# EasyEDA Pro project Samuel_Quenching.eprj

# Schematic NV_Quenching_Schematic
Board Name: Samuel; Create Date: 2026-01-16; Page Name: P1; Project Name: Samuel_Quenching; Schematic Name: NV_Quenching_Schematic; Update Date: 2026-01-16; Company: Fraunhofer IAO; Drawn: Jens; Page Size: A4; Reviewed: Samuel; Version: V2.0
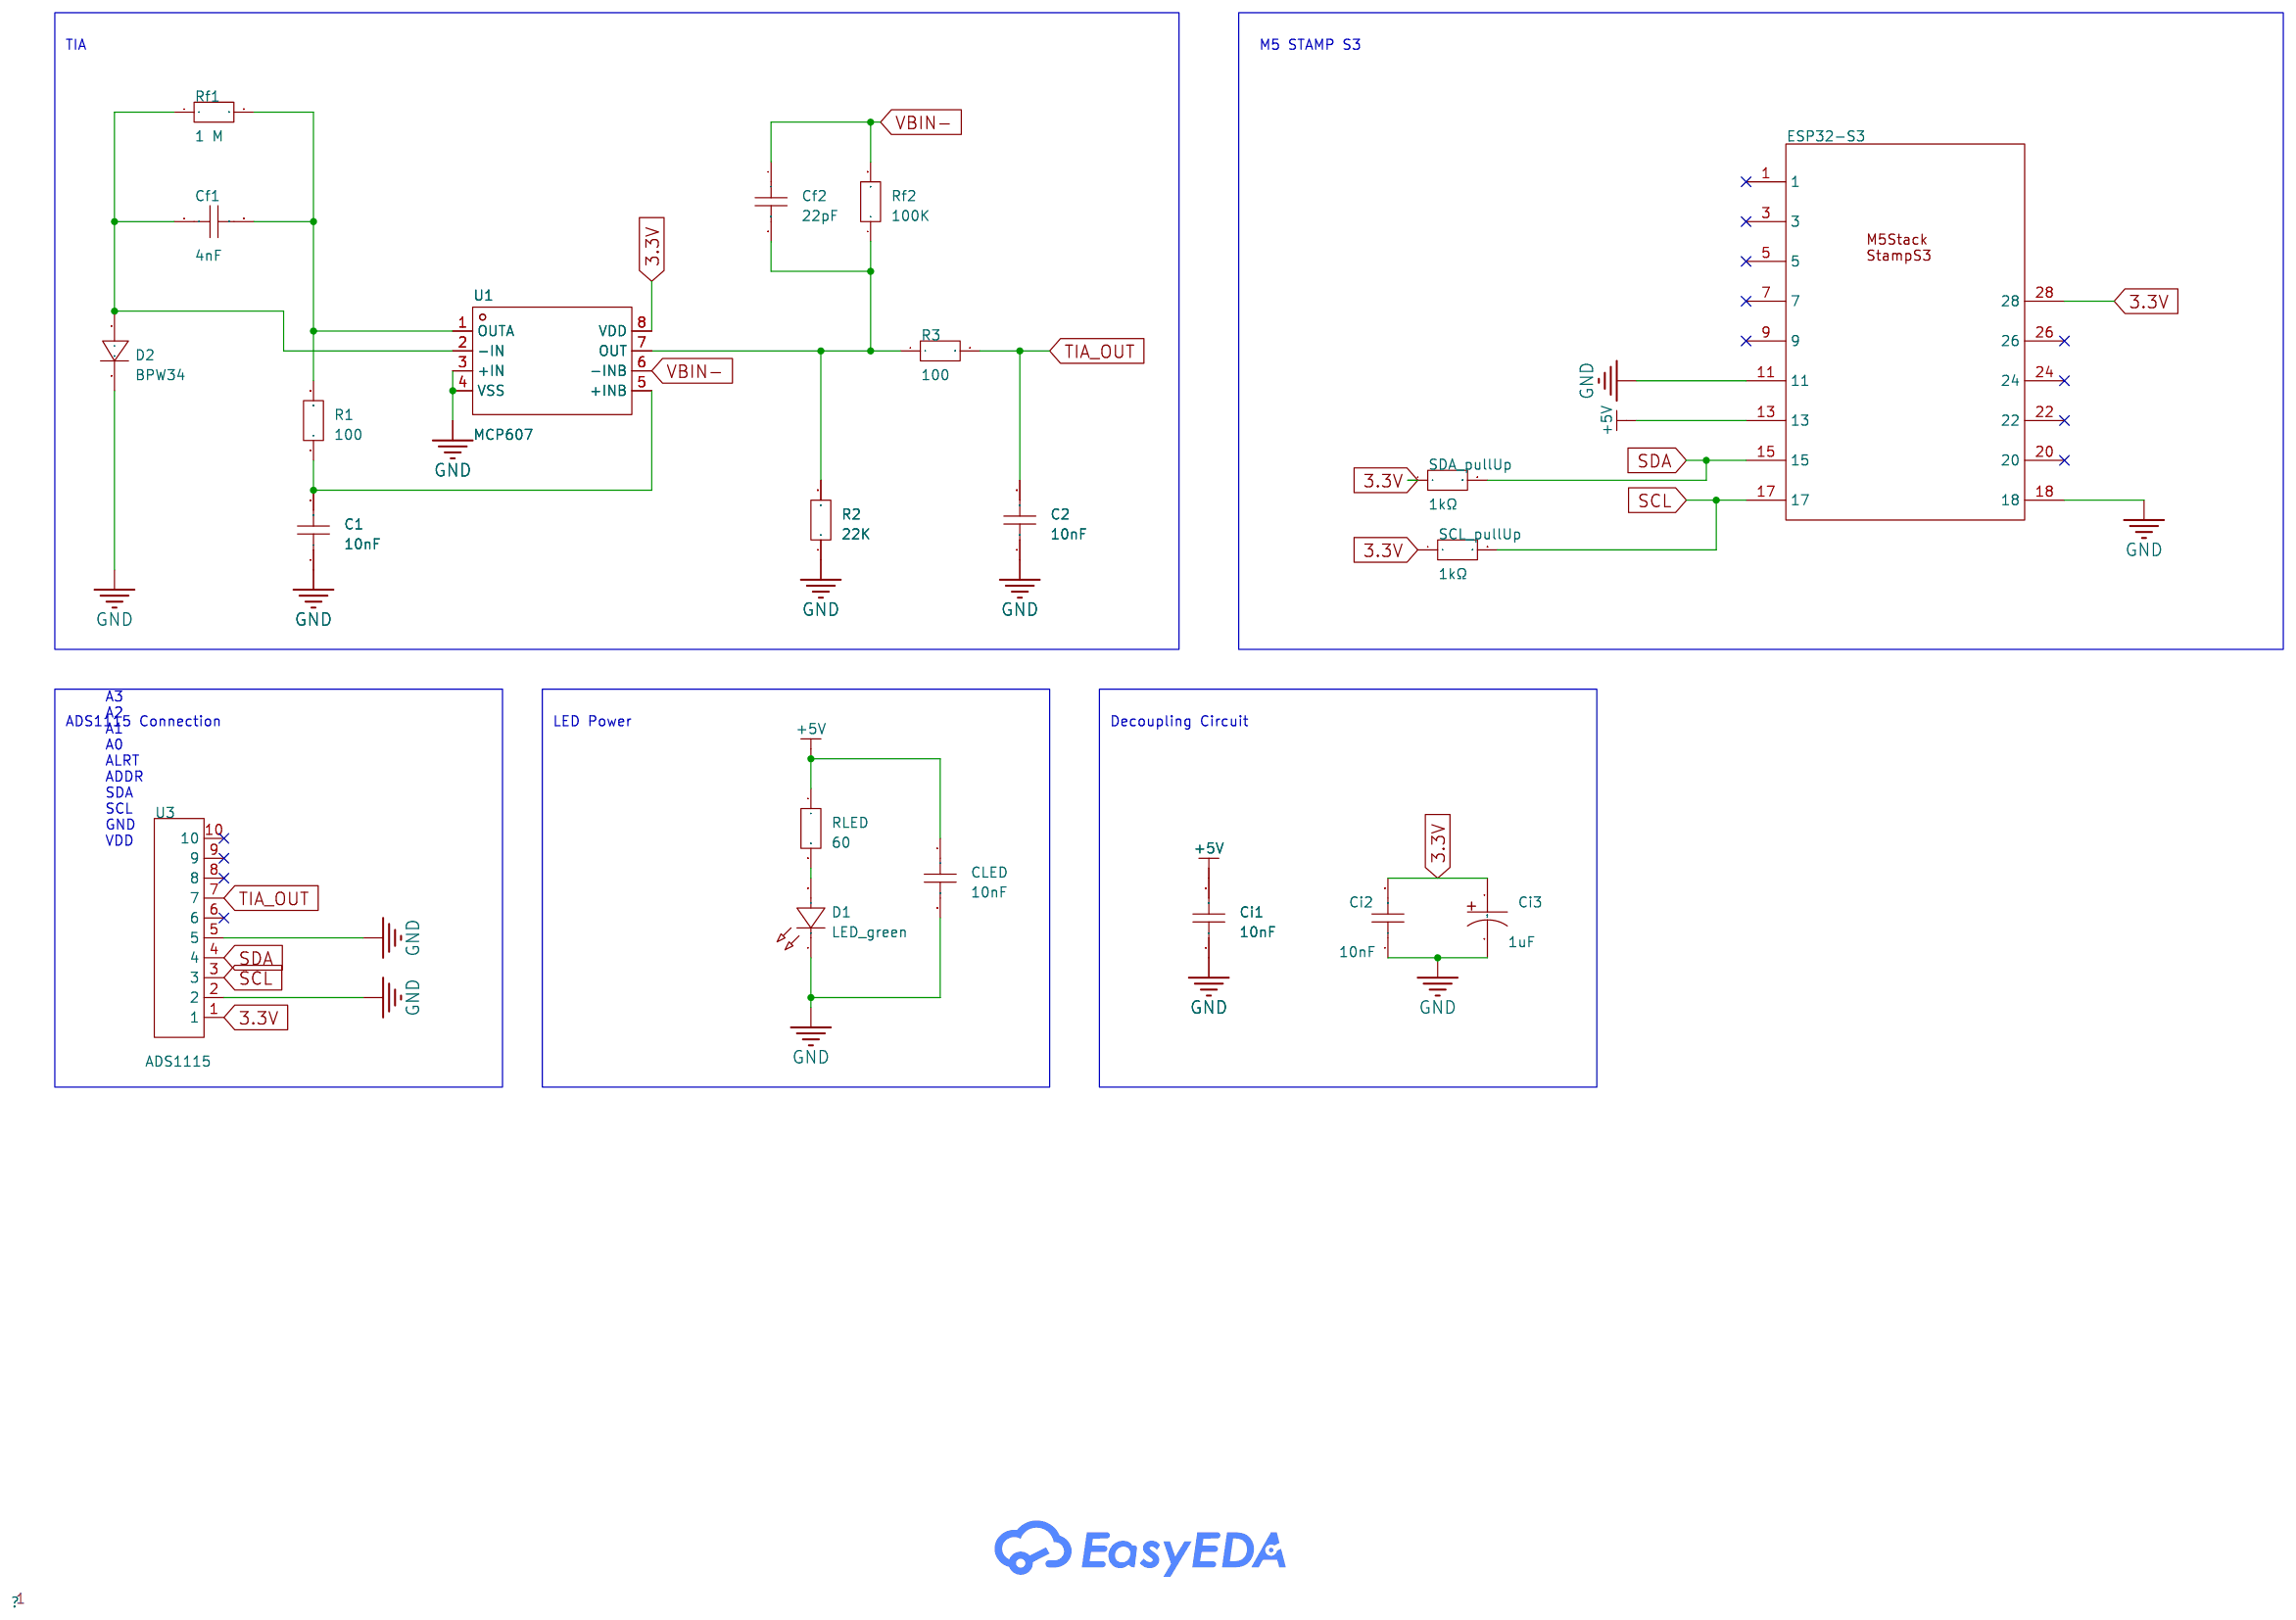
[diagram p0: schematic sheet]

## Parts
C1  2.2nF  [CAP-TH_L6.0-W3.0-P5.00-D1.0]
C2  2.2nF  [CAP-TH_L6.0-W3.0-P5.00-D1.0]
Cf1  2.2nF  [CAP-TH_L6.0-W3.0-P5.00-D1.0]
Cf2  2.2nF  [CAP-TH_L6.0-W3.0-P5.00-D1.0]
Ci1  2.2nF  [CAP-TH_L6.0-W3.0-P5.00-D1.0]
Ci2  2.2nF  [CAP-TH_L6.0-W3.0-P5.00-D1.0]
Ci3  20F  [CAP-TH_BD5.0-P2.00-D0.5-FD_CD26G2AM1R0D110T]
CLED  2.2nF  [CAP-TH_L6.0-W3.0-P5.00-D1.0]
D1  LED_green  [LED-TH_BD3.5-P2.28-3A2K-10]
D2  BPW34  [SENSOR-TH_BPW34]
ESP32-S3  U2  [M5Stack StampS3 ]  (no BOM)
R1  1kΩ  [RES-TH_BD2.3-L6.5-P10.50-D0.5]
R2  1kΩ  [RES-TH_BD2.3-L6.5-P10.50-D0.5]
R3  1kΩ  [RES-TH_BD2.3-L6.5-P10.50-D0.5]
Rf1  1kΩ  [RES-TH_BD2.3-L6.5-P10.50-D0.5]
Rf2  1kΩ  [RES-TH_BD2.3-L6.5-P10.50-D0.5]
RLED  1kΩ  [RES-TH_BD2.3-L6.5-P10.50-D0.5]
SCL_pullUp  1kΩ  [RES-TH_BD2.3-L6.5-P10.50-D0.5]
SDA_pullUp  1kΩ  [RES-TH_BD2.3-L6.5-P10.50-D0.5]
U1  MCP607  [DIP-8_L9.4-W6.4-P2.54-LS9.1-BL]
U3  ADS1115  [HDR-TH_10P-P2.54-V-M-1]

## Library data of the parts
C1 C2 Cf1 Cf2 Ci1 Ci2 CLED = R06F1B222MN0B0S0N0: Capacitance:2.2nF Tolerance:±20% Tolerance:±20% Voltage Rating:2kV Pin Spacing:5mm Temperature Coefficient:Y5V Diameter:6mm Body Thickness:3mm; LCSC Part Name: 2.2nF ±20% 2kV; Supplier Part: C249167; Manufacturer: STE(松田); Supplier Footprint: 插件,P=5mm; JLCPCB Part Class: Extended Part; Datasheet: https://item.szlcsc.com/datasheet/R06F1B222MN0B0S0N0/245526.html; Supplier: LCSC; Tolerance: ±20%; Voltage Rating: 2kV; Pin Spacing: 5mm; Temperature Coefficient: Y5V; Diameter: 6mm; Body Thickness: 3mm
Ci3 = SLA3R8O2060813: Capacitance:20F Tolerance:-10%~+30% Tolerance:-10%~+30% Voltage Rating:3.8V Equivalent Series Resistance(ESR):500mΩ Current - Leakage:- Lifetime:1000hrs@85℃ Operating Temperature:-40℃~+85℃ Operating Temperature:-40℃~+85℃ Diameter:8mm Height - Seated(Max):; LCSC Part Name: 20F -10%~+30% 3.8V; Supplier Part: C970391; Manufacturer: Ymin(永铭); Supplier Footprint: 插件,P=3.5mm; JLCPCB Part Class: Extended Part; Datasheet: https://item.szlcsc.com/datasheet/SLA3R8O2060813/1059775.html; Supplier: LCSC; Tolerance: -10%~+30%; Voltage Rating: 3.8V; Equivalent Series Resistance(ESR): 500mΩ; Lifetime: 1000hrs@85℃; Operating Temperature: -40℃~+85℃; Diameter: 8mm
D1 = 3A2K-10: Voltage - DC Reverse(Vr):30V Peak Wavelength:940nm Spectral Range:760nm~1100nm Spectral Range:760nm~1100nm Dark Current:100nA Operating Temperature:-40℃~+85℃ Operating Temperature:-40℃~+85℃; LCSC Part Name: 3mm黑色红外光敏接收管; Supplier Part: C52034729; Manufacturer: Guiguang light(桂光光电); Supplier Footprint: 插件,D=3mm; JLCPCB Part Class: Extended Part; Datasheet: https://item.szlcsc.com/datasheet/3A2K-10/54791047.html; Supplier: LCSC; Voltage - DC Reverse(Vr): 30V; Peak Wavelength: 940nm; Spectral Range: 760nm~1100nm; Dark Current: 100nA; Operating Temperature: -40℃~+85℃
D2 = BPW34: Voltage - DC Reverse(Vr):60V Viewing Angle:±65° Peak Wavelength:900nm Spectral Range:430nm~1100nm Spectral Range:430nm~1100nm Dark Current:2nA Operating Temperature:-40℃~+100℃ Operating Temperature:-40℃~+100℃ Pd - Power Dissipation:215mW; LCSC Part Name: 900nm 频谱范围430nm~1100nm 反向电压60V; Supplier Part: C85128; Manufacturer: VISHAY(威世); Supplier Footprint: 插件,P=5.1mm; JLCPCB Part Class: Extended Part; Datasheet: https://item.szlcsc.com/datasheet/BPW34/86300.html; Supplier: LCSC; Voltage - DC Reverse(Vr): 60V; Viewing Angle: ±65°; Peak Wavelength: 900nm; Spectral Range: 430nm~1100nm; Dark Current: 2nA; Operating Temperature: -40℃~+100℃; Pd - Power Dissipation: 215mW
ESP32-S3 = Esp32-S3 M5Stamp
R1-R3 Rf1 Rf2 RLED SCL_pullUp SDA_pullUp = MF1/4W-1KΩ±1%T52: Type:Metal Film Resistors Resistance: Tolerance:±1% Tolerance:±1% Power(Watts):250mW Temperature Coefficient:±200ppm/℃ Temperature Coefficient:±200ppm/℃; LCSC Part Name: 金属膜电阻 1kΩ ±1% 250mW; Supplier Part: C713997; Manufacturer: 华星机电; Supplier Footprint: 插件,D2.3xL6.5mm; JLCPCB Part Class: Extended Part; Datasheet: https://atta.szlcsc.com/upload/public/pdf/source/20200731/C713882_AE8EB1102749D7E4FB4FB13DC898C429.pdf; Supplier: LCSC; Type: Metal Film Resistors; Tolerance: ±1%; Power(Watts): 250mW; Temperature Coefficient: ±200ppm/℃
U1 = MCP607-I/P: Number of Circuits:双路 Gain Bandwidth Product(GBP):155kHz Current - Input Bias(Ib):1pA Slew Rate(SR):0.08V/us Output Current:17mA -3db Bandwidth:- Output Type:- Rail to Rail:- Supply Current:18.7uA Operating Temperature:-40℃~+85℃ Operating Temperature:-40℃; Supplier Part: C57348; Manufacturer: MICROCHIP(美国微芯); Supplier Footprint: DIP-8; JLCPCB Part Class: Extended Part; Datasheet: https://atta.szlcsc.com/upload/public/pdf/source/20170105/1483610774992.pdf; Supplier: LCSC; Number of Circuits: 双路; Gain Bandwidth Product(GBP): 155kHz; Current - Input Bias(Ib): 1pA; Slew Rate(SR): 0.08V/us; Output Current: 17mA; Supply Current: 18.7uA; Operating Temperature: -40℃~+85℃
U3 = 2.54-1*10P针: Pin Structure:1x10P Pitch:2.54mm Row Spacing:- Circluar Pins/Square Pins:Policy Mounting Type:Straight Number of Rows:Single Row Number of Pins:10P Current Rating:3A Voltage Rating (Max):- Length of Mating Pin:- Insulation Height:- Length of End Connectio; LCSC Part Name: 1x10P 间距:2.54mm 方针 直插; Supplier Part: C57369; Manufacturer: BOOMELE(博穆精密); Supplier Footprint: 插件,P=2.54mm; JLCPCB Part Class: Extended Part; Datasheet: https://atta.szlcsc.com/upload/public/pdf/source/20151109/1457707572883.pdf; Supplier: LCSC; Pin Structure: 1x10P; Pitch: 2.54mm; Circluar Pins/Square Pins: Policy; Mounting Type: Straight; Number of Rows: Single Row; Number of Pins: 10P; Current Rating: 3A; Operating Temperature: -40℃~+105℃; Color: Black

## Nets
3.3V: Ci2.2 Ci3.1 ESP32-S3.28 SCL_pullUp.1 SDA_pullUp.1 U1.8(VDD) U3.1
+5V: Ci1.2 CLED.1 ESP32-S3.13 RLED.1
GND: C1.1 C2.1 Ci1.1 Ci2.1 Ci3.2 CLED.2 D1.1(C) D2.2(C) ESP32-S3.11 ESP32-S3.18 R2.1 U1.3(+IN) U1.4(VSS) U3.2 U3.5
SCL: ESP32-S3.17 SCL_pullUp.2 U3.3
SDA: ESP32-S3.15 SDA_pullUp.2 U3.4
TIA_OUT: C2.2 R3.2 U3.7
VBIN-: Cf2.1 Rf2.2 U1.6(-INB)
$1N1714: D1.2(A) RLED.2
$1N1854: Cf1.1 D2.1(A) Rf1.1 U1.2(-IN)
$1N1856: Cf1.2 R1.2 Rf1.2 U1.1(OUTA)
$1N1900: C1.2 R1.1 U1.5(+INB)
$1N1918: Cf2.2 R2.2 R3.1 Rf2.1 U1.7(OUT)

Not connected (* = marked no-connect by the designer): ESP32-S3 1* 3* 5* 7* 9* 20* 22* 24* 26*; U3 6* 8* 9* 10*

## Notes on the sheet
- TIA
- M5 STAMP S3
- ADS1115 Connection
- LED Power
- Decoupling Circuit
- A3
  A2
  A1
  A0
  ALRT
  ADDR
  SDA
  SCL
  GND
  VDD

# Board NV_Quenching_PCB
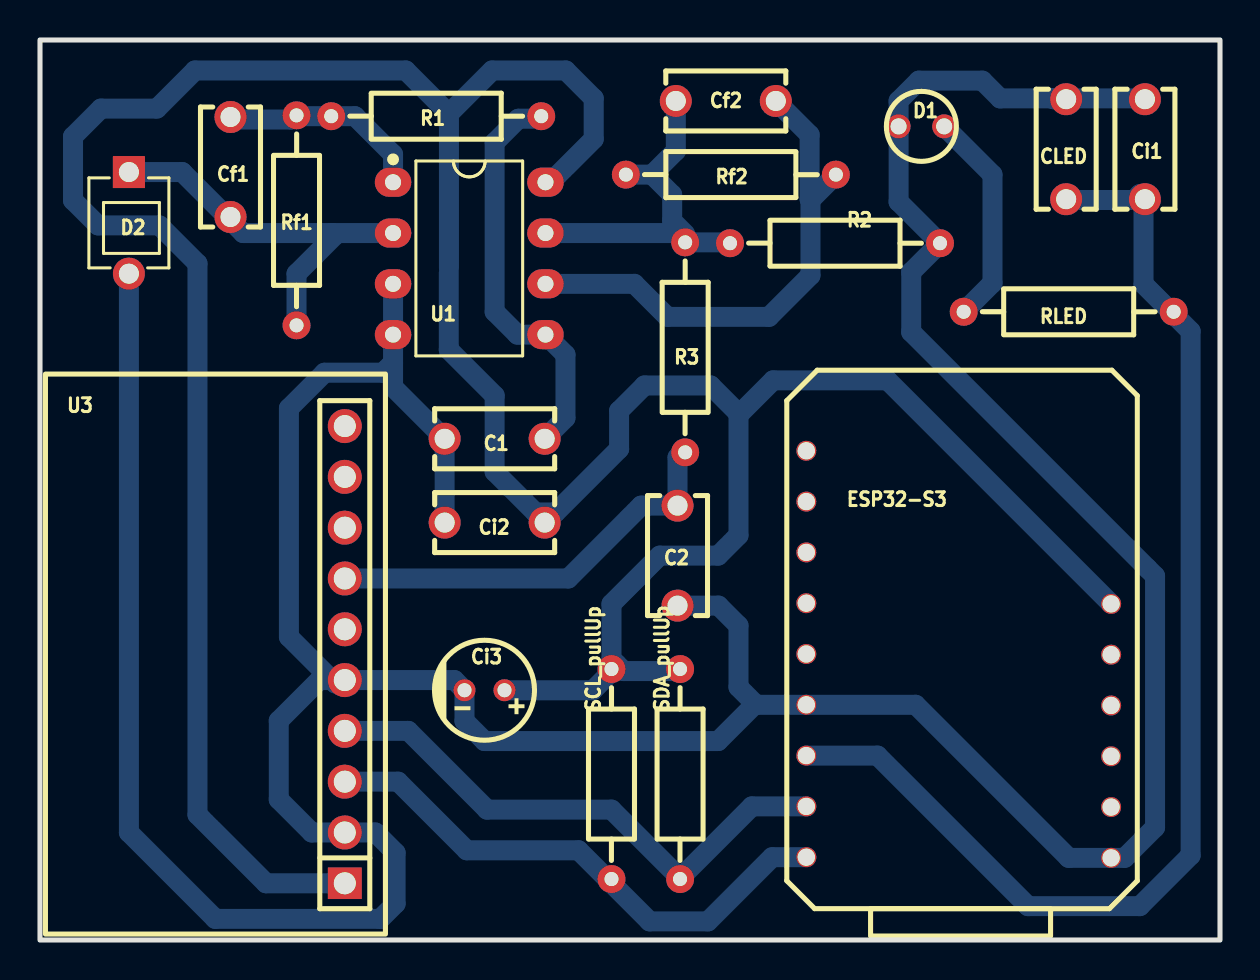
[diagram p1: board, top side]
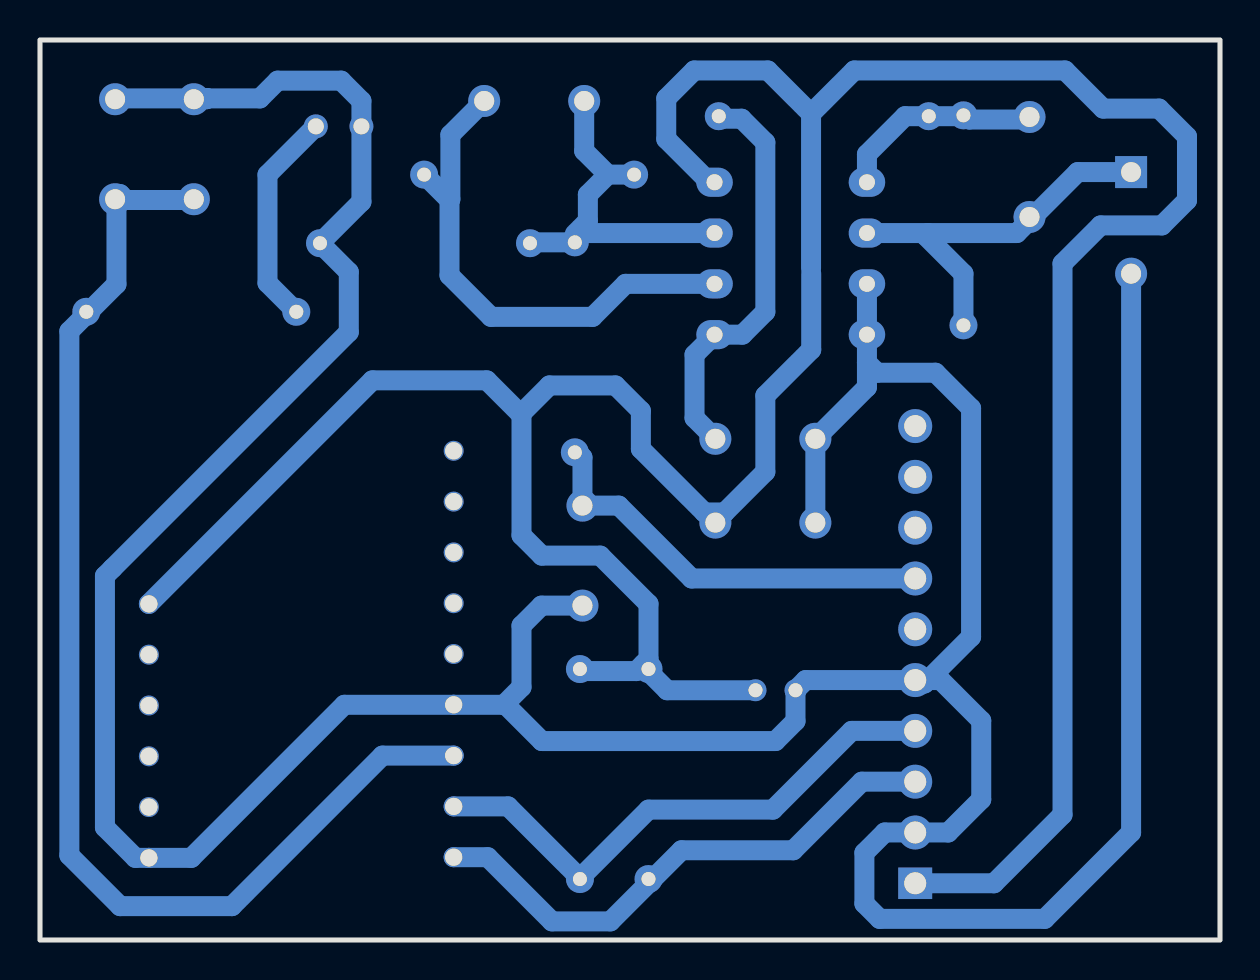
[diagram p2: board, bottom side, seen from below]

Outline 59 x 45 mm; copper layers: Top Layer, Bottom Layer. Coordinates in mm from the lower left corner of the outline.
Outline path: rectangle 0,45 59,0
Stack: Top Layer 0.035mm / Dielectric1 1.51mm FR4 er 4.5 / Bottom Layer 0.035mm

## Design rules (mm)
template: Custom Config
spacing copperThickness1oz (default): track to track 0.102, other pairs 0.152 to 0.3
spacing copperThickness2oz: track to track 0.203, other pairs 0.152 to 0.3
track width copperThickness1oz (default): min 0.254, default 0.54, max 2.54
track width copperThickness2oz: min 0.203, default 0.254, max 2.54
differential pair differentialPair (default): width min 0.127, default 0.254, max 2.54; gap min 0.152, default 0.152
via viaSize (default): diameter min 0.5, default 0.61, max 10; hole min 0.3, default 0.305, max 6.3
net GND uses copperRegion1, copperThickness2oz
net +5V uses copperThickness2oz
net 3.3V uses copperThickness2oz

## Placement (name value [footprint] x y rotation side)
C1  2.2nF  [CAP-TH_L6.0-W3.0-P5.00-D1.0]  22.73 25.06 0 top
C2  2.2nF  [CAP-TH_L6.0-W3.0-P5.00-D1.0]  31.88 19.22 90 top
Cf1  2.2nF  [CAP-TH_L6.0-W3.0-P5.00-D1.0]  9.53 38.65 90 top
Cf2  2.2nF  [CAP-TH_L6.0-W3.0-P5.00-D1.0]  34.29 41.95 180 top
Ci1  2.2nF  [CAP-TH_L6.0-W3.0-P5.00-D1.0]  55.25 39.54 270 top
Ci2  2.2nF  [CAP-TH_L6.0-W3.0-P5.00-D1.0]  22.73 20.87 0 top
Ci3  20F  [CAP-TH_BD5.0-P2.00-D0.5-FD_CD26G2AM1R0D110T]  22.22 12.49 180 top
CLED  2.2nF  [CAP-TH_L6.0-W3.0-P5.00-D1.0]  51.31 39.54 90 top
D1  LED_green  [LED-TH_BD3.5-P2.28-3A2K-10]  44.07 40.68 180 top
D2  BPW34  [SENSOR-TH_BPW34]  4.44 35.86 270 top
ESP32-S3  U2  [M5Stack StampS3 ]  45.85 14.52 0 top
R1  1kΩ  [RES-TH_BD2.3-L6.5-P10.50-D0.5]  19.81 41.19 180 top
R2  1kΩ  [RES-TH_BD2.3-L6.5-P10.50-D0.5]  39.75 34.84 180 top
R3  1kΩ  [RES-TH_BD2.3-L6.5-P10.50-D0.5]  32.26 29.63 270 top
Rf1  1kΩ  [RES-TH_BD2.3-L6.5-P10.50-D0.5]  12.83 35.98 90 top
Rf2  1kΩ  [RES-TH_BD2.3-L6.5-P10.50-D0.5]  34.54 38.27 0 top
RLED  1kΩ  [RES-TH_BD2.3-L6.5-P10.50-D0.5]  51.44 31.41 180 top
SCL_pullUp  1kΩ  [RES-TH_BD2.3-L6.5-P10.50-D0.5]  28.57 8.3 270 top
SDA_pullUp  1kΩ  [RES-TH_BD2.3-L6.5-P10.50-D0.5]  32 8.3 270 top
U1  MCP607  [DIP-8_L9.4-W6.4-P2.54-LS9.1-BL]  21.46 34.08 270 top
U3  ADS1115  [HDR-TH_10P-P2.54-V-M-1]  15.24 14.27 90 top

## Footprints (pads in the part's own frame, mm; a bottom-side part is the same pattern mirrored in y, then rotated)
CAP-TH_BD5.0-P2.00-D0.5-FD_CD26G2AM1R0D110T
  round 1.1 hole 0.7: 1(-1,0) 2(1,0)
CAP-TH_L6.0-W3.0-P5.00-D1.0
  round 1.6 hole 1: 1(-2.5,0) 2(2.5,0)
DIP-8_L9.4-W6.4-P2.54-LS9.1-BL
  oval 1.46x1.825 hole 0.8: 1(-3.81,-3.81) 2(-1.27,-3.81) 3(1.27,-3.81) 4(3.81,-3.81) 5(3.81,3.81) 6(1.27,3.81) 7(-1.27,3.81) 8(-3.81,3.81)
HDR-TH_10P-P2.54-V-M-1
  rect 1.575x1.7 hole 1.1: 1(-11.43,0)
  round 1.7 hole 1.1: 2(-8.89,0) 3(-6.35,0) 4(-3.81,0) 5(-1.27,0) 6(1.27,0) 7(3.81,0) 8(6.35,0) 9(8.89,0) 10(11.43,0)
LED-TH_BD3.5-P2.28-3A2K-10
  round 1.2 hole 0.8: 1(1.14,0) 2(-1.14,0)
M5Stack StampS3 
  round 1 hole 0.86: 1(-7.531,9.94) 3(-7.531,7.4) 5(-7.531,4.86) 7(-7.531,2.32) 9(-7.531,-0.22) 11(-7.531,-2.76) 13(-7.531,-5.3) 15(-7.531,-7.84) 17(-7.531,-10.38) 18(7.709,-10.414) 20(7.709,-7.874) 22(7.709,-5.334) 24(7.709,-2.794) 26(7.709,-0.254) 28(7.709,2.286)
RES-TH_BD2.3-L6.5-P10.50-D0.5
  round 1.4 hole 0.7: 1(-5.25,0) 2(5.25,0)
SENSOR-TH_BPW34
  rect 1.6x1.6 hole 1: 1(-2.54,0)
  round 1.6 hole 1: 2(2.54,0)

## Nets
As in the schematic.

Pads without a net: ESP32-S3 1 3 5 7 9 20 22 24 26; U3 6 8 9 10

## Routing (per net, layer and track width the routed paths; a pad name or vN(x,y) marks a point on that pad's centre or on a via; arc(x,y) is an arc through that point)
3.3V: length 168.6
  Bottom Layer w0.8: 28.83,13.8 SCL_pullUp.1
  Bottom Layer w1: 34.93,26.25 36.66,27.98 42.38,27.98 ESP32-S3.28 ; 34.93,26.25 34.93,20.23 33.91,19.22 30.99,19.22 28.57,16.81 28.57,14.06 29.18,13.45 31.9,13.45 SDA_pullUp.1 ; 34.93,26.25 34.93,26.33 33.53,27.73 30.23,27.73 28.96,26.46 28.96,24.55 25.78,21.38 24.76,21.38 22.73,23.41 22.73,27.22 20.44,29.51 20.44,33.32 ; 20.45,41.32 22.61,43.48 26.29,43.48 27.69,42.08 27.69,40.05 25.53,37.89 U1.8 ; 20.45,41.32 18.29,43.48 7.75,43.48 5.84,41.57 3.05,41.57 1.65,40.17 1.65,36.98 2.91,35.73 5.97,35.73 7.87,33.82 7.87,6.27 11.3,2.84 U3.1 ; 20.45,41.32 20.45,33.59 ; Ci3.1 27.64,12.49 28.64,13.48
+5V: length 61.4
  Bottom Layer w1: CLED.1 51.35,37 54.7,37 54.99,37.29 55.18,37.11 ; 55.18,37.11 55.18,32.79 57.53,30.44 57.53,4.23 54.99,1.69 49.4,1.69 41.88,9.22 ESP32-S3.13 ; 55.18,37.11 Ci1.2
GND: length 207.7
  Bottom Layer w1: 50.63,42.08 48.01,42.08 47.12,42.97 43.94,42.97 42.93,41.95 D1.1 42.93,36.91 R2.1 43.56,33.4 43.56,30.39 55.75,18.2 55.75,5.63 54.23,4.11 ESP32-S3.18 51.44,4.11 43.78,11.76 ESP32-S3.11 35.81,11.76 ; 50.63,42.08 50.67,42.04 CLED.2 50.67,42.08 ; 50.63,42.08 50.65,42.1 50.67,42.08 ; U1.3 U1.4 17.65,28.87 ; 50.67,42.08 55.21,42.08 Ci1.1 ; 35.81,11.76 34.93,12.64 34.93,15.72 33.93,16.72 C2.1 ; 35.81,11.76 35.72,11.76 33.91,9.95 22.22,9.95 21.22,10.95 Ci3.2 20.72,13 U3.5 ; U3.5 15.07,12.82 14.78,12.82 14.6,13 ; U3.5 14.6,13 ; 17.65,28.87 17.65,27.64 C1.1 Ci2.1 ; 17.65,28.87 17.15,28.36 14.22,28.36 12.45,26.58 12.45,15.16 14.6,13 ; D2.2 4.44,5.38 8.76,1.06 17.02,1.06 17.78,1.82 17.78,4.36 16.76,5.38 U3.2 13.59,5.38 11.94,7.03 11.94,10.96 13.97,13 14.6,13
SCL: length 27.3
  Bottom Layer w1: ESP32-S3.17 36.61,4.14 33.4,0.93 30.48,0.93 26.92,4.49 21.34,4.49 17.91,7.92 U3.3
SDA: length 27.6
  Bottom Layer w1: ESP32-S3.15 35.59,6.68 32,3.09 28.57,6.52 22.35,6.52 18.41,10.46 U3.4
TIA_OUT: length 21
  Bottom Layer w1: U3.7 26.42,18.08 30.06,21.72 C2.2 31.88,24.13 32.13,24.38 R3.2
VBIN-: length 26
  Bottom Layer w1: 38.52,37 38.48,37.04 38.48,40.26 Cf2.1 ; 38.52,37 38.52,33.23 36.45,31.16 31.37,31.16 29.72,32.81 U1.6 ; 38.52,37 Rf2.2
$1N1714: length 10.9
  Bottom Layer w1: D1.2 47.62,38.27 47.62,32.85 RLED.2
$1N1854: length 19.9
  Bottom Layer w1: U1.2 14.6,35.35 ; 14.6,35.35 10.16,35.35 7.11,38.4 D2.1 ; 14.6,35.35 14.73,35.22 12.83,33.32 Rf1.1
$1N1856: length 10.4
  Bottom Layer w1: 9.53,41.02 12.53,41.02 12.7,41.19 R1.2 15.75,41.19 17.65,39.28 U1.1
$1N1900: length 20.5
  Bottom Layer w1: C1.2 26.27,26.1 26.27,29.27 U1.5 23.88,30.27 22.73,31.41 22.73,39.88 23.92,41.06 25.02,41.06 25.06,41.11 R1.1
$1N1918: length 17.9
  Bottom Layer w1: 30.61,38.27 31.79,39.45 Cf2.2 ; 30.61,38.27 31.61,37.27 31.61,35.96 32.26,35.31 ; 30.61,38.27 Rf2.1 ; U1.7 31.79,35.35 ; R2.2 34.46,34.88 R3.1
